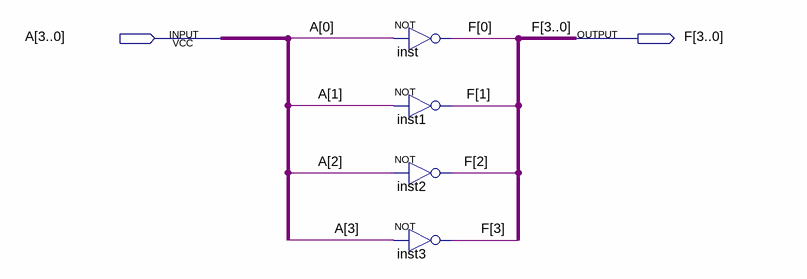
[diagram p0: schematic sheet]
// Quartus schematic 4b_not.bdf as structural Verilog: 4 symbols, 2 pins
module \4b_not  (
  input  [3:0] A,
  output [3:0] F
);

  not inst (F[0], A[0]);
  not inst1 (F[1], A[1]);
  not inst2 (F[2], A[2]);
  not inst3 (F[3], A[3]);
endmodule
